# EAGLE schematic TDA7053A Stereo (EAGLE 6.2)
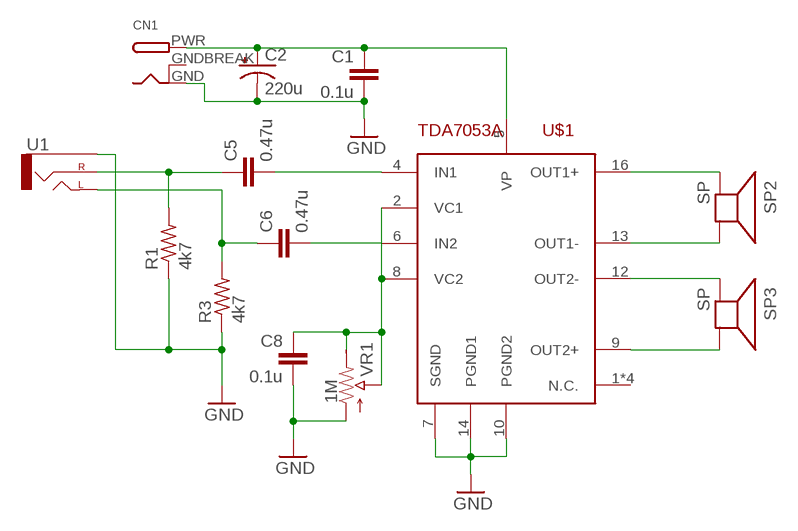
[diagram p0: schematic, sheet 1]

## Parts
C1  0.1u  CAPPTH2  [CAP-PTH-SMALL2]
C2  220u  CAP_POLPTH1  [CPOL-RADIAL-100UF-25V]
C5  0.47u  CAPPTH2  [CAP-PTH-SMALL2]
C6  0.47u  CAPPTH2  [CAP-PTH-SMALL2]
C8  0.1u  CAPPTH2  [CAP-PTH-SMALL2]
CN1  DCBARRELPTH  [DCJACK_2MM_PTH]
R1  4k7  R-US_0204/5  [0204/5]
R3  4k7  R-US_0204/5  [0204/5]
SP2  SP  [PS12]
SP3  SP  [PS12]
U1  AUDIO-JACKPTH  [AUDIO-JACK]
U$1  TDA7053A  [DIL16]
VR1  1M  POT-RV16AF-20  [POT_ALPHA_RV16AF-20]

## Nets
GND: C1.2 C2.2(-) C8.2 CN1.GND R1.1 R3.1 U1.SLEEVE U$1.7(SGND) U$1.10(PGND2) U$1.14(PGND1) VR1.1(A)
N$4: C5.1 R1.2 U1.RING(RIGHT)
N$6: C6.1 R3.2 U1.TIP(LEFT)
N$7: SP3.P$2(-) U$1.9(OUT2+)
N$10: SP3.P$1(+) U$1.12(OUT2-)
N$11: SP2.P$2(-) U$1.13(OUT1-)
N$12: SP2.P$1(+) U$1.16(OUT1+)
N$14: C6.2 U$1.6(IN2)
N$15: C5.2 U$1.4(IN1)
N$17: C1.1 C2.1(+) CN1.PWR U$1.5(VP)
N$19: C8.1 U$1.2(VC1) U$1.8(VC2) VR1.2(S) VR1.3(E)
Unconnected: U$1.1(N.C.) U$1.3(N.C.) U$1.11(N.C.) U$1.15(N.C.)

## Power pins joined to a net without a drawn wire
GNDBREAK: CN1.GNDBREAK

## Library data of the parts
C1 C5 C6 C8 = SparkFun:CAP: Capacitor Standard 0603 ceramic capacitor, and 0.1" leaded capacitor.
C2 = SparkFun:CAP_POL: Capacitor Polarized These are standard SMD and PTH capacitors. Normally 10uF, 47uF, and 100uF in electrolytic and tantalum varieties. Always verify the external diameter of the through hole cap, it varies with capacity, voltage, and manufacturer. The EIA devices should be standard.
CN1 = adafruit:DCBARREL: 2.0mm DC Barrel Jack DCJACK_2MM_PTH - Through Hole Jack (4UConnector: 05537)
R1 R3 = adafruit:R-US_: RESISTOR, American symbol
SP2 SP3 = My Library:SP: SPEAKER Source: Buerklin Added PS12 (for part # PS1240 piezo) http://www.ladyada.net/library/pcb/eaglelibrary.html
U1 = SparkFun:AUDIO-JACK: 3.5mm Audio Jack Simple 3.5mm common PCB mount audio jack. SKU: PRT-08032
U$1 = My Library:TDA7053A
VR1 = My Library:POT